# EAGLE schematic controller_v2 (EAGLE 8.7.0)
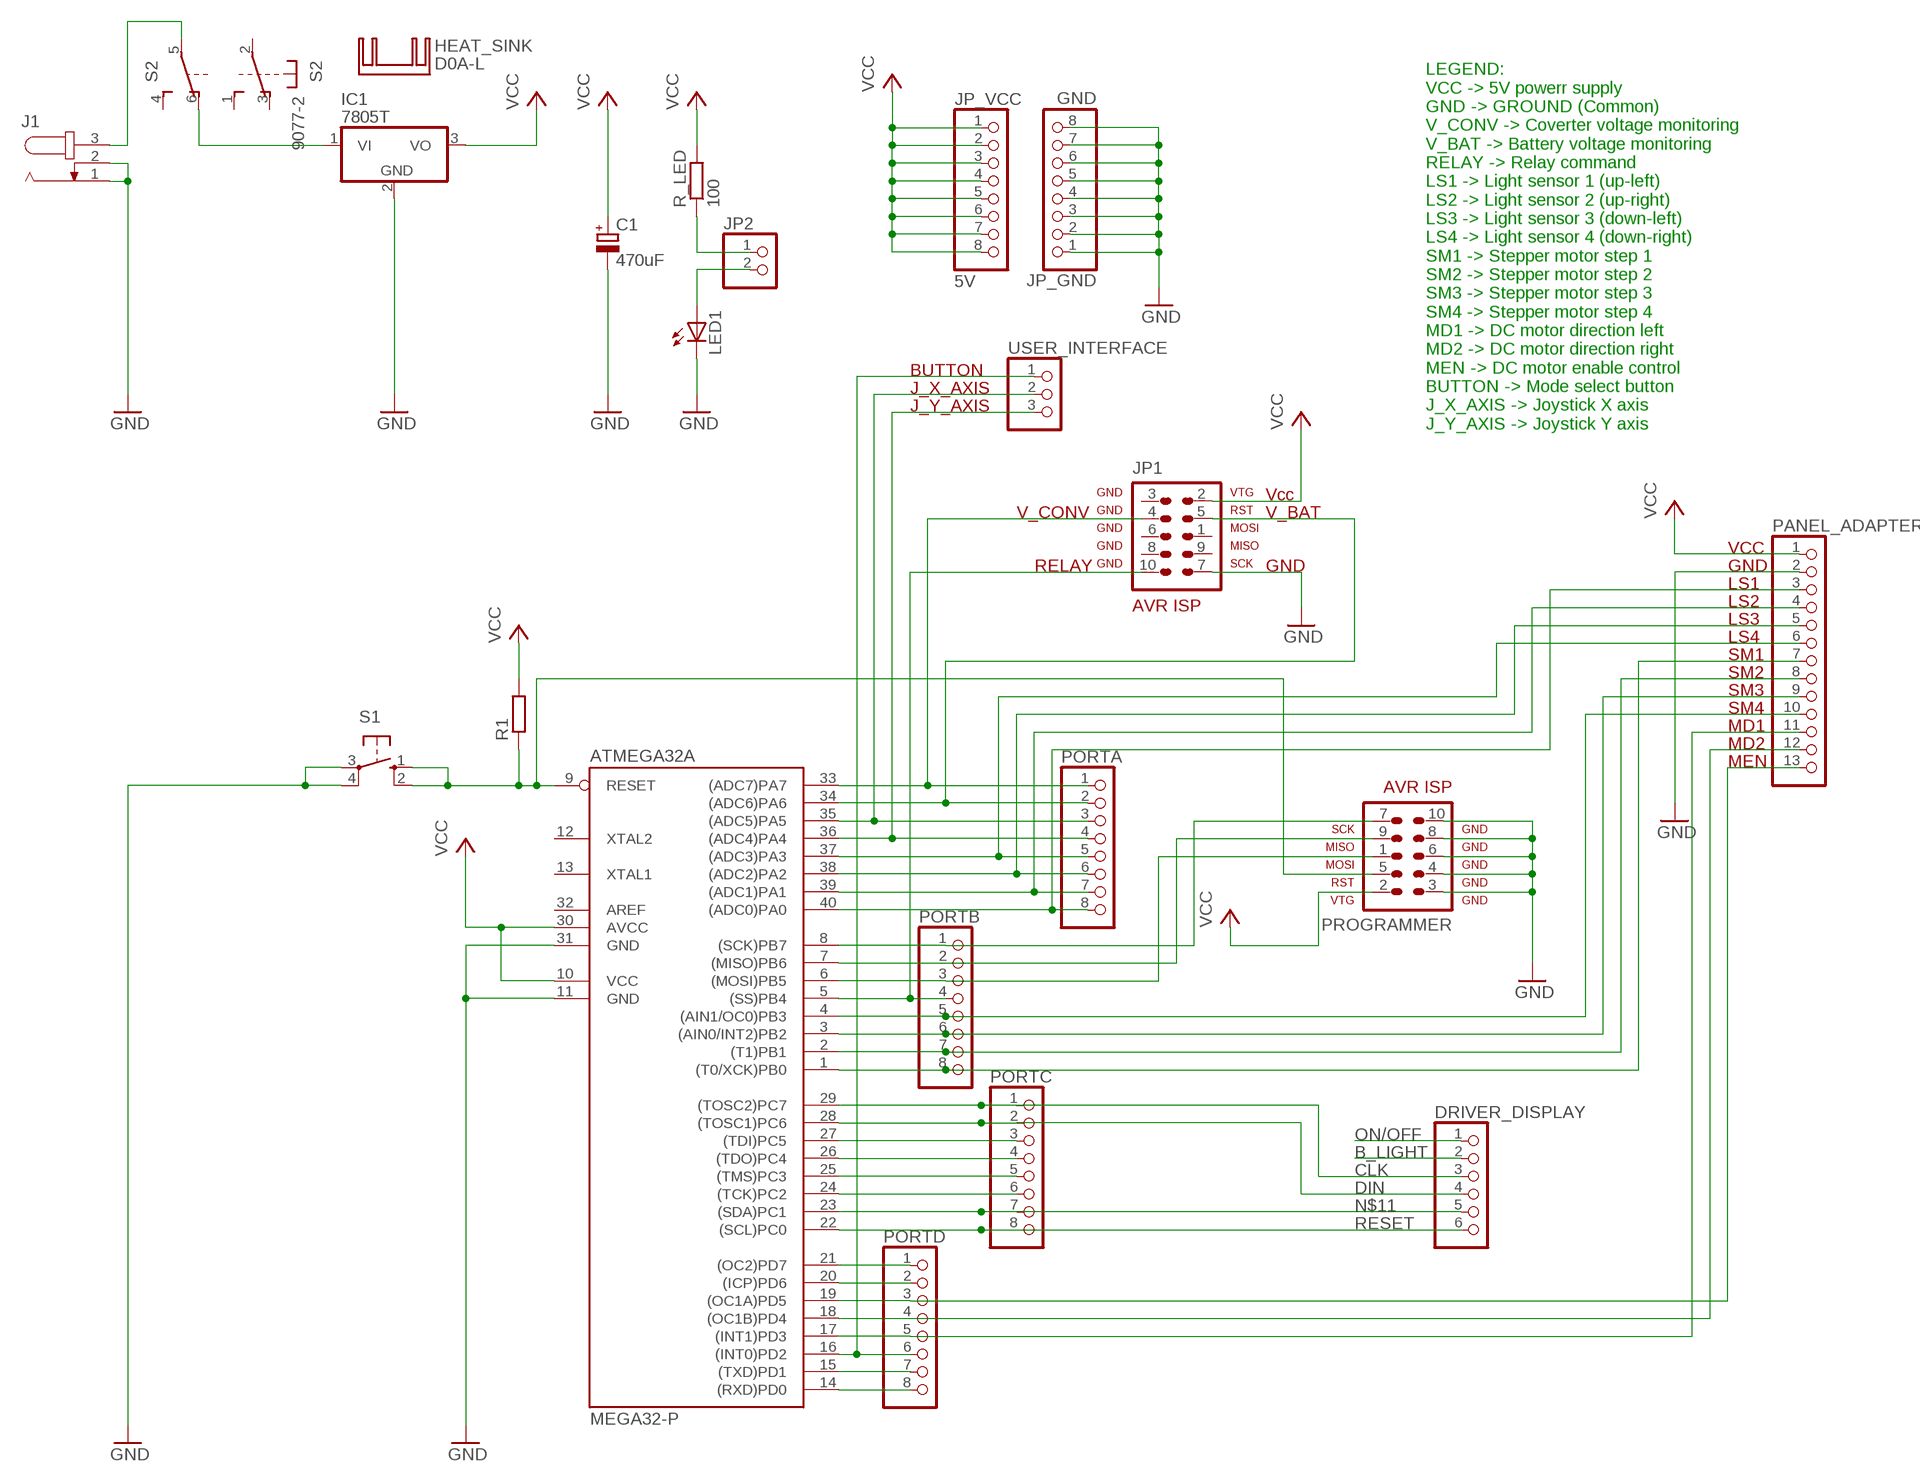
[diagram p0: schematic, sheet 1]

## Parts
ATMEGA32A  MEGA32-P  [DIL40]
C1  470uF  CPOL-EUE3.5-8  [E3,5-8]
DRIVER_DISPLAY  PINHD-1X6  [1X06]
HEAT_SINK  D0A-L  [D02A-L]
IC1  7805T  [TO220H]
J1  JACK-PLUG0  [SPC4077]
JP1  AVR-ISP-10  [AVR-ISP-10]
JP2  PINHD-1X2  [1X02]
JP_GND  GND  PINHD-1X8  [1X08]
JP_VCC  5V  PINHD-1X8  [1X08]
LED1  LED5MM  [LED5MM]
PANEL_ADAPTER  PINHD-1X13  [1X13]
PORTA  PINHD-1X8  [1X08]
PORTB  PINHD-1X8  [1X08]
PORTC  PINHD-1X8  [1X08]
PORTD  PINHD-1X8  [1X08]
PROGRAMMER  AVR-ISP-10  [AVR-ISP-10]
R1  R-EU_0207/10  [0207/10]
R_LED  100  R-EU_0207/10  [0207/10]
S1  10-XX  [B3F-10XX]
S2  9077-2  [9077-2]
USER_INTERFACE  PINHD-1X3  [1X03]

## Nets
B_LIGHT: DRIVER_DISPLAY.2
CLK: ATMEGA32A.29((TOSC2)PC7) DRIVER_DISPLAY.3 PORTC.1
DIN: ATMEGA32A.28((TOSC1)PC6) DRIVER_DISPLAY.4 PORTC.2
GND: ATMEGA32A.11(GND) ATMEGA32A.31(GND) C1.- IC1.2(GND) J1.1 J1.2 JP1.7 JP_GND.1 JP_GND.2 JP_GND.3 JP_GND.4 JP_GND.5 JP_GND.6 JP_GND.7 JP_GND.8 LED1.K(C) PANEL_ADAPTER.2 PROGRAMMER.3 PROGRAMMER.4 PROGRAMMER.6 PROGRAMMER.8 PROGRAMMER.10 S1.3(P) S1.4(P1)
N$1: ATMEGA32A.9(RESET) PROGRAMMER.5 R1.1 S1.1(S) S1.2(S1)
N$2: ATMEGA32A.40((ADC0)PA0) PANEL_ADAPTER.3 PORTA.8
N$3: J1.3 S2.5(2:P)
N$4: ATMEGA32A.39((ADC1)PA1) PANEL_ADAPTER.4 PORTA.7
N$5: ATMEGA32A.21((OC2)PD7) PORTD.1
N$6: ATMEGA32A.17((INT1)PD3) PANEL_ADAPTER.11 PORTD.5
N$7: ATMEGA32A.19((OC1A)PD5) PANEL_ADAPTER.13 PORTD.3
N$8: ATMEGA32A.16((INT0)PD2) PORTD.6 USER_INTERFACE.1
N$9: ATMEGA32A.38((ADC2)PA2) PANEL_ADAPTER.5 PORTA.6
N$10: ATMEGA32A.37((ADC3)PA3) PANEL_ADAPTER.6 PORTA.5
N$11: ATMEGA32A.23((SDA)PC1) DRIVER_DISPLAY.5 PORTC.7
N$12: JP2.1 R_LED.1
N$13: ATMEGA32A.24((TCK)PC2) PORTC.6
N$14: ATMEGA32A.25((TMS)PC3) PORTC.5
N$15: ATMEGA32A.26((TDO)PC4) PORTC.4
N$16: ATMEGA32A.27((TDI)PC5) PORTC.3
N$17: JP2.2 LED1.A
N$19: ATMEGA32A.1((T0/XCK)PB0) PANEL_ADAPTER.7 PORTB.8
N$20: ATMEGA32A.2((T1)PB1) PANEL_ADAPTER.8 PORTB.7
N$21: ATMEGA32A.3((AIN0/INT2)PB2) PANEL_ADAPTER.9 PORTB.6
N$22: ATMEGA32A.4((AIN1/OC0)PB3) PANEL_ADAPTER.10 PORTB.5
N$23: ATMEGA32A.5((SS)PB4) JP1.10 PORTB.4
N$24: ATMEGA32A.6((MOSI)PB5) PORTB.3 PROGRAMMER.1
N$25: ATMEGA32A.7((MISO)PB6) PORTB.2 PROGRAMMER.9
N$26: ATMEGA32A.8((SCK)PB7) PORTB.1 PROGRAMMER.7
N$27: ATMEGA32A.20((ICP)PD6) PORTD.2
N$28: ATMEGA32A.15((TXD)PD1) PORTD.7
N$29: ATMEGA32A.14((RXD)PD0) PORTD.8
N$31: ATMEGA32A.36((ADC4)PA4) PORTA.4 USER_INTERFACE.3
N$32: ATMEGA32A.35((ADC5)PA5) PORTA.3 USER_INTERFACE.2
N$33: ATMEGA32A.34((ADC6)PA6) JP1.5 PORTA.2
N$34: ATMEGA32A.33((ADC7)PA7) JP1.4 PORTA.1
N$35: IC1.1(VI) S2.6(2:O)
N$36: ATMEGA32A.18((OC1B)PD4) PANEL_ADAPTER.12 PORTD.4
ON/OFF: DRIVER_DISPLAY.1
RESET: ATMEGA32A.22((SCL)PC0) DRIVER_DISPLAY.6 PORTC.8
VCC: ATMEGA32A.10(VCC) ATMEGA32A.30(AVCC) C1.+ IC1.3(VO) JP1.2 JP_VCC.1 JP_VCC.2 JP_VCC.3 JP_VCC.4 JP_VCC.5 JP_VCC.6 JP_VCC.7 JP_VCC.8 PANEL_ADAPTER.1 PROGRAMMER.2 R1.2 R_LED.2
Unconnected: ATMEGA32A.12(XTAL2) ATMEGA32A.13(XTAL1) ATMEGA32A.32(AREF) JP1.1 JP1.3 JP1.6 JP1.8 JP1.9 S2.1(1:S) S2.2(1:P) S2.3(1:O) S2.4(2:S)

## Notes on the sheet
- BUTTON
- J_X_AXIS
- J_Y_AXIS
- LEGEND:
  VCC -> 5V powerr supply
  GND -> GROUND (Common)
  V_CONV -> Coverter voltage monitoring
  V_BAT -> Battery voltage monitoring
  RELAY -> Relay command
  LS1 -> Light sensor 1 (up-left)
  LS2 -> Light sensor 2 (up-right)
  LS3 -> Light sensor 3 (down-left)
  LS4 -> Light sensor 4 (down-right)
  SM1 -> Stepper motor step 1
  SM2 -> Stepper motor step 2
  SM3 -> Stepper motor step 3
  SM4 -> Stepper motor step 4 
  MD1 -> DC motor direction left
  MD2 -> DC motor direction right
  MEN -> DC motor enable control
  BUTTON -> Mode select button
  J_X_AXIS -> Joystick X axis
  J_Y_AXIS -> Joystick Y axis
- Vcc
- V_CONV | V_BAT
- VCC
- RELAY | GND | GND
- LS1
- LS2
- LS3
- LS4
- SM1
- SM2
- SM3
- SM4
- MD1
- MD2
- MEN

## Library data of the parts
ATMEGA32A = atmel:MEGA32-P: MICROCONTROLLER 32 Kbytes FLASH 2 Kbytes SRAM 1 Kbytes EEPROM USART 8-channel 10 bit ADC Source: www.atmel.com .. doc2503.pdf; MPN: ATMEGA32-16PU; OC_FARNELL: 1661729; OC_NEWARK: 51P1794
C1 = rcl:CPOL-EU: POLARIZED CAPACITOR, European symbol; SPICEPREFIX: C
DRIVER_DISPLAY = pinhead:PINHD-1X6: PIN HEADER
HEAT_SINK = heatsink:D0A-L: HEATSINK distributor Schukat
IC1 = linear:78*: Positive VOLTAGE REGULATOR Source: http://cache.national.com/ds/LM/LM78L05.pdf http://www.fairchildsemi.com/ds/LM/LM7805.pdf
J1 = con-jack:JACK-PLUG: DC POWER JACK Power Jack, DC, Right Angle, Through Hole, Rated 5A at 16VDC, PC Terminals Distributor: Farnell (www.Farnell.de) Drawing: 84N1161.pdf / 84N1162.pdf Manufacturer: SPC Technology (www.spctechnology.com) Type: SPC4077 / SPC 4078; OC_FARNELL: unknown; OC_NEWARK: unknown
JP1 PROGRAMMER = avr-7:AVR-ISP-10: AVR ISP-10 Serial Programming Header
JP2 = pinhead:PINHD-1X2: PIN HEADER
JP_GND JP_VCC PORTA PORTB PORTC PORTD = pinhead:PINHD-1X8: PIN HEADER
LED1 = led:LED: LED OSRAM: - CHIPLED LG R971, LG N971, LY N971, LG Q971, LY Q971, LO R971, LY R971 LH N974, LH R974 LS Q976, LO Q976, LY Q976 LO Q996 - Hyper CHIPLED LW Q18S LB Q993, LB Q99A, LB R99A - SideLED LS A670, LO A670, LY A670, LG A670, LP A670 LB A673, LV A673, LT A673, LW A673 LH A674 LY A675 LS A676, LA A676, LO A676, LY A676, LW A676 LS A679, LY A679, LG A679 - Hyper Micro SIDELED® LS Y876, LA Y876, LO Y876, LY Y876 LT Y87S - SmartLED LW L88C, LW L88S LB L89C, LB L89S, LG L890 LS L89K, LO L89K, LY L89K LS L896, LA L896, LO L896, LY L896 - TOPLED LS T670, LO T670, LY T670, LG T670, LP T670 LSG T670, LSP T670, LSY T670, LOP T670, LYG T670 LG T671, LOG T671, LSG T671 LB T673, LV T673, LT T673, LW T673 LH T674 LS T676, LA T676, LO T676, LY T676, LB T676, LH T676, LSB T676, LW T676 LB T67C, LV T67C, LT T67C, LS T67K, LO T67K, LY T67K, LW E67C LS E67B, LA E67B, LO E67B, LY E67B, LB E67C, LV E67C, LT E67C LW T67C LS T679, LY T679, LG T679 LS T770, LO T770, LY T770, LG T770, LP T770 LB T773, LV T773, LT T773, LW T773 LH T774 LS E675, LA E675, LY E675, LS T675 LS T776, LA T776, LO T776, LY T776, LB T776 LHGB T686 LT T68C, LB T68C - Hyper Mini TOPLED® LB M676 - Mini TOPLED Santana® LG M470 LS M47K, LO M47K, LY M47K Source: http://www.osram.convergy.de LUXEON: - LUMILED® LXK2-PW12-R00, LXK2-PW12-S00, LXK2-PW14-U00, LXK2-PW14-V00 LXK2-PM12-R00, LXK2-PM12-S00, LXK2-PM14-U00 LXK2-PE12-Q00, LXK2-PE12-R00, LXK2-PE12-S00, LXK2-PE14-T00, LXK2-PE14-U00 LXK2-PB12-K00, LXK2-PB12-L00, LXK2-PB12-M00, LXK2-PB14-N00, LXK2-PB14-P00, LXK2-PB14-Q00 LXK2-PR12-L00, LXK2-PR12-M00, LXK2-PR14-Q00, LXK2-PR14-R00 LXK2-PD12-Q00, LXK2-PD12-R00, LXK2-PD12-S00 LXK2-PH12-R00, LXK2-PH12-S00 LXK2-PL12-P00, LXK2-PL12-Q00, LXK2-PL12-R00 Source: www.luxeon.com KINGBRIGHT: KA-3528ASYC Source: www.kingbright.com
PANEL_ADAPTER = pinhead:PINHD-1X13: PIN HEADER
R1 R_LED = rcl:R-EU_: RESISTOR, European symbol; SPICEPREFIX: R
S1 = switch-omron:10-XX: OMRON SWITCH; MPN: B3F-1000; OC_FARNELL: 176432; OC_NEWARK: 36M3542
S2 = switch-misc:9077-2: MARQUARDT SWITCH 9077.0200 Distributor: Buerklin <https://www.buerklin.com/default.asp?event=ShowArtikel%2812G2822%29&l=d&jump=ArtNr_12G2822>
USER_INTERFACE = pinhead:PINHD-1X3: PIN HEADER